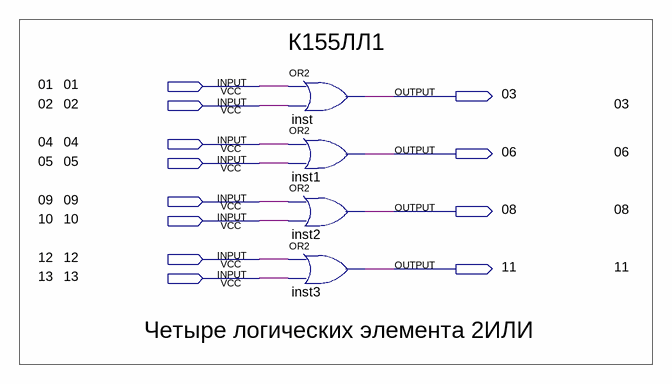
[diagram p0: schematic sheet]
// Quartus schematic K155LL1.bdf as structural Verilog: 4 symbols, 12 pins
module K155LL1 (
  input  \01 ,
  input  \02 ,
  input  \04 ,
  input  \05 ,
  input  \09 ,
  input  \10 ,
  input  \12 ,
  input  \13 ,
  output \03 ,
  output \06 ,
  output \08 ,
  output \11 
);

  or inst (\03 , \01 , \02 );
  or inst1 (\06 , \04 , \05 );
  or inst2 (\08 , \09 , \10 );
  or inst3 (\11 , \12 , \13 );

  // Notes on the sheet:
  //   К155ЛЛ1
  //   01
  //   02
  //   03
  //   04
  //   06
  //   05
  //   09
  //   08
  //   10
  //   12
  //   11
  //   13
  //   Четыре логических элемента 2ИЛИ
endmodule
